# EAGLE design Sensor LF (EAGLE 7.2.0)
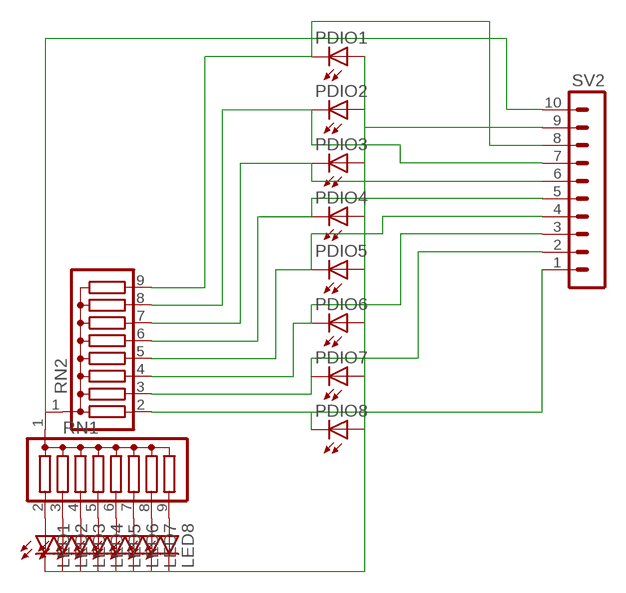
[diagram p0: schematic, sheet 1]

## Parts
LED1  LED3MM  [LED3MM]
LED2  LED3MM  [LED3MM]
LED3  LED3MM  [LED3MM]
LED4  LED3MM  [LED3MM]
LED5  LED3MM  [LED3MM]
LED6  LED3MM  [LED3MM]
LED7  LED3MM  [LED3MM]
LED8  LED3MM  [LED3MM]
PDIO1  LED3MM  [LED3MM]
PDIO2  LED3MM  [LED3MM]
PDIO3  LED3MM  [LED3MM]
PDIO4  LED3MM  [LED3MM]
PDIO5  LED3MM  [LED3MM]
PDIO6  LED3MM  [LED3MM]
PDIO7  LED3MM  [LED3MM]
PDIO8  LED3MM  [LED3MM]
RN1  G08R  [SIL9]
RN2  G08R  [SIL9]
SV2  MA10-1  [MA10-1]

## Nets
GND: LED1.K(C) LED2.K(C) LED3.K(C) LED4.K(C) LED5.K(C) LED6.K(C) LED7.K(C) LED8.K(C) PDIO1.A PDIO2.A PDIO3.A PDIO4.A PDIO5.A PDIO6.A PDIO7.A PDIO8.A SV2.9
N$2: LED1.A RN1.2
N$3: LED2.A RN1.3
N$4: LED3.A RN1.4
N$5: LED4.A RN1.5
N$6: LED5.A RN1.6
N$7: LED6.A RN1.7
N$8: LED7.A RN1.8
N$9: LED8.A RN1.9
N$10: PDIO8.K(C) RN2.2 SV2.1
N$12: PDIO6.K(C) RN2.4 SV2.3
N$15: PDIO3.K(C) RN2.7 SV2.6
N$16: PDIO2.K(C) RN2.8 SV2.7
N$18: PDIO7.K(C) RN2.3 SV2.2
N$23: PDIO5.K(C) RN2.5 SV2.4
N$25: PDIO4.K(C) RN2.6 SV2.5
N$29: PDIO1.K(C) RN2.9 SV2.8
VCC: RN1.1 RN2.1 SV2.10

## Library data of the parts
LED1-LED8 PDIO1-PDIO8 = led:LED: LED OSRAM: - CHIPLED LG R971, LG N971, LY N971, LG Q971, LY Q971, LO R971, LY R971 LH N974, LH R974 LS Q976, LO Q976, LY Q976 LO Q996 - Hyper CHIPLED LW Q18S LB Q993, LB Q99A, LB R99A - SideLED LS A670, LO A670, LY A670, LG A670, LP A670 LB A673, LV A673, LT A673, LW A673 LH A674 LY A675 LS A676, LA A676, LO A676, LY A676, LW A676 LS A679, LY A679, LG A679 - Hyper Micro SIDELED® LS Y876, LA Y876, LO Y876, LY Y876 LT Y87S - SmartLED LW L88C, LW L88S LB L89C, LB L89S, LG L890 LS L89K, LO L89K, LY L89K LS L896, LA L896, LO L896, LY L896 - TOPLED LS T670, LO T670, LY T670, LG T670, LP T670 LSG T670, LSP T670, LSY T670, LOP T670, LYG T670 LG T671, LOG T671, LSG T671 LB T673, LV T673, LT T673, LW T673 LH T674 LS T676, LA T676, LO T676, LY T676, LB T676, LH T676, LSB T676, LW T676 LB T67C, LV T67C, LT T67C, LS T67K, LO T67K, LY T67K, LW E67C LS E67B, LA E67B, LO E67B, LY E67B, LB E67C, LV E67C, LT E67C LW T67C LS T679, LY T679, LG T679 LS T770, LO T770, LY T770, LG T770, LP T770 LB T773, LV T773, LT T773, LW T773 LH T774 LS E675, LA E675, LY E675, LS T675 LS T776, LA T776, LO T776, LY T776, LB T776 LHGB T686 LT T68C, LB T68C - Hyper Mini TOPLED® LB M676 - Mini TOPLED Santana® LG M470 LS M47K, LO M47K, LY M47K Source: http://www.osram.convergy.de LUXEON: - LUMILED® LXK2-PW12-R00, LXK2-PW12-S00, LXK2-PW14-U00, LXK2-PW14-V00 LXK2-PM12-R00, LXK2-PM12-S00, LXK2-PM14-U00 LXK2-PE12-Q00, LXK2-PE12-R00, LXK2-PE12-S00, LXK2-PE14-T00, LXK2-PE14-U00 LXK2-PB12-K00, LXK2-PB12-L00, LXK2-PB12-M00, LXK2-PB14-N00, LXK2-PB14-P00, LXK2-PB14-Q00 LXK2-PR12-L00, LXK2-PR12-M00, LXK2-PR14-Q00, LXK2-PR14-R00 LXK2-PD12-Q00, LXK2-PD12-R00, LXK2-PD12-S00 LXK2-PH12-R00, LXK2-PH12-S00 LXK2-PL12-P00, LXK2-PL12-Q00, LXK2-PL12-R00 Source: www.luxeon.com KINGBRIGHT: KA-3528ASYC Source: www.kingbright.com
RN1 RN2 = resistor-sil:G08R: SIL RESISTOR; OC_FARNELL: unknown; OC_NEWARK: unknown
SV2 = con-lstb:MA10-1: PIN HEADER; OC_FARNELL: unknown; OC_NEWARK: unknown

## Net classes
0 default: width 0.051 mm, clearance 0.051 mm

## Board
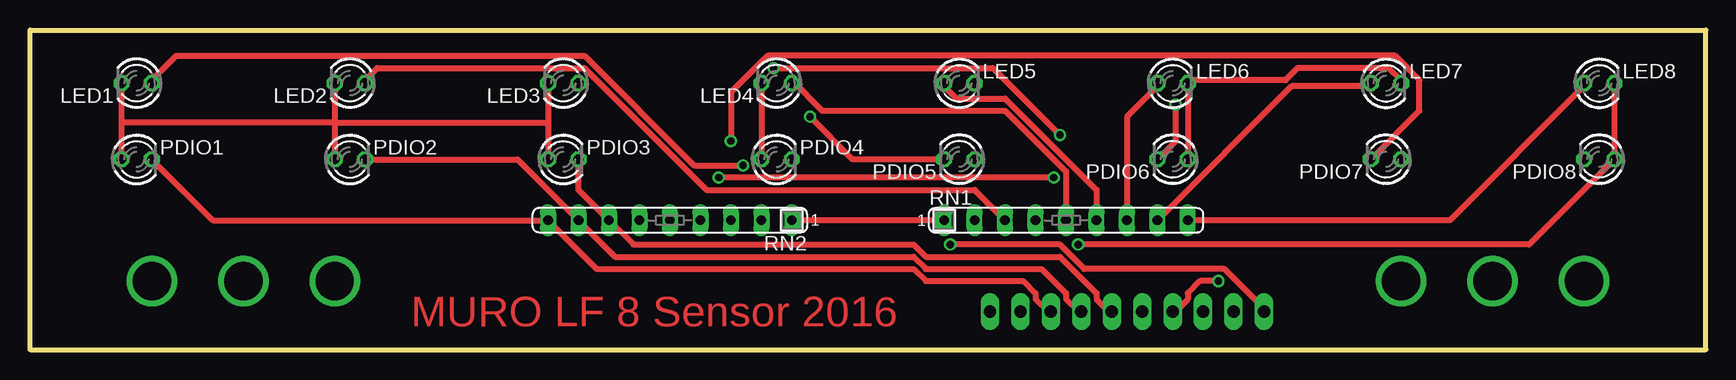
[diagram p1: board, top side]
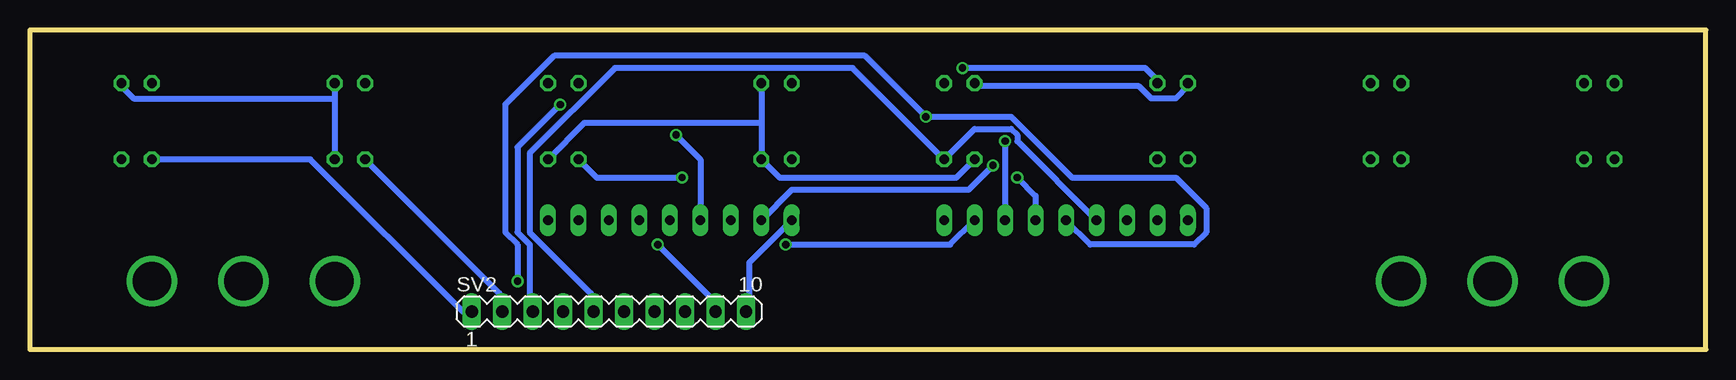
[diagram p2: board, bottom side, seen from below]

Size 139.7 x 26.67 mm. Coordinates in mm from the lower left corner, seen from the top.
Outline: 0,0 139.7,0 139.7,26.67 0,26.67 0,0
Copper layers (1*16): Top 0.035mm / dielectric 1.5mm / Bottom 0.035mm
Design rules "default *": minimum track width 20mil, minimum drill 24mil, track to track 8mil, track to pad 8mil, pad to pad 8mil, via to via 8mil, smd to smd 8mil, copper to edge 40mil, drill to drill 8mil, minimum pad ring 10mil, minimum via ring 8mil, stop-mask expansion 4mil, vias tented up to drill 0mil, thermal gap 10mil

### Footprints (pad centres in the part's own frame; a part is rotated, then mirrored left to right if it is on the bottom)
LED3MM = drill 0.813 octagon: A -1.27,0; K 1.27,0
SIL9 = drill 0.813 long: 1 -10.16,0; 2 -7.62,0; 3 -5.08,0; 4 -2.54,0; 5 0,0; 6 2.54,0; 7 5.08,0; 8 7.62,0; 9 10.16,0
MA10-1 = drill 1.016 long: 1 -11.43,0; 2 -8.89,0; 3 -6.35,0; 4 -3.81,0; 5 -1.27,0; 6 1.27,0; 7 3.81,0; 8 6.35,0; 9 8.89,0; 10 11.43,0

### Placement (x,y rotation side)
LED1  8.89,22.23 180 top
LED2  26.67,22.23 180 top
LED3  44.45,22.23 180 top
LED4  62.23,22.23 180 top
LED5  77.47,22.23 0 top
LED6  95.25,22.23 0 top
LED7  113.03,22.23 0 top
LED8  130.81,22.23 0 top
PDIO1  8.89,15.88 0 top
PDIO2  26.67,15.88 0 top
PDIO3  44.45,15.88 0 top
PDIO4  62.23,15.88 0 top
PDIO5  77.47,15.88 180 top
PDIO6  95.25,15.88 180 top
PDIO7  113.03,15.88 180 top
PDIO8  130.81,15.88 180 top
RN1  86.36,10.8 0 top
RN2  53.34,10.8 180 top
SV2  91.44,3.18 0 bottom

### Tracks (layer width: path | path; a pad name or v marks a point on that pad's centre or on a via)
A  (via drill 3.2)
  other vias: 129.54,5.72
GND  (via drill 0.61)
  Top 0.508: LED4.K PDIO4.A | LED3.K 43.18,18.92 | 43.18,18.92 PDIO3.A | LED1.K 7.62,18.92 | 7.62,18.92 PDIO1.A | LED2.K 25.4,18.92 | 25.4,18.92 PDIO2.A | 25.4,18.92 7.62,18.92 | 25.4,18.92 43.18,18.92 | PDIO6.A LED6.K 96.52,22.48 104.65,22.48 105.66,23.5 113.28,23.5 114.3,22.48 LED7.K | LED8.K PDIO8.A 124.97,8.76 v87.38,8.76
  Bottom 0.508: LED4.K 60.96,21.97 47.24,21.97 46.23,20.96 44.2,20.96 43.18,21.97 LED3.K | LED5.K 78.74,18.92 | 78.74,18.92 PDIO5.A 77.22,14.35 62.48,14.35 PDIO4.A | 78.74,18.92 93.47,18.92 PDIO6.A | LED7.K 114.3,20.96 | 114.3,20.96 PDIO7.A | v87.38,8.76 82.8,4.19 82.8,3.18 SV2.9 | 114.3,20.96 131.06,20.96 132.08,21.97 LED8.K
N$2  (via drill 0.61)
  Top 0.508: v59.44,15.37 55.37,15.37 46.23,24.51 12.19,24.51 10.16,22.48 LED1.A
  Bottom 0.508: RN1.2 76.2,13.34 61.47,13.34 v59.44,15.37
N$3
  Top 0.508: RN1.3 78.74,13.34 56.39,13.34 46.23,23.5 28.96,23.5 27.94,22.48 LED2.A
N$4  (via drill 0.61)
  Top 0.508: v85.85,17.91 80.26,23.5 v61.98,23.5
  Bottom 0.508: RN1.4 83.82,15.88 v85.85,17.91 | v61.98,23.5 46.74,23.5 45.72,22.48 LED3.A
N$5
  Top 0.508: RN1.5 86.36,14.86 81.28,19.94 66.04,19.94 63.5,22.48 LED4.A
N$6
  Top 0.508: RN1.6 88.9,13.34 81.28,20.96 77.22,20.96 76.2,21.97 LED5.A
N$7
  Top 0.508: RN1.7 91.44,19.43 93.98,21.97 LED6.A
N$8
  Top 0.508: RN1.8 105.16,21.97 111.76,21.97 LED7.A
N$9
  Top 0.508: RN1.9 118.36,10.8 129.54,21.97 LED8.A
N$10  (via drill 0.61)
  Top 0.508: v76.71,8.76 85.85,8.76 87.88,6.73 99.57,6.73 103.12,3.18 SV2.1
  Bottom 0.508: RN2.2 62.99,8.76 v76.71,8.76 | PDIO8.K 116.33,15.88 103.63,3.18 SV2.1
N$12  (via drill 0.61)
  Top 0.508: v85.34,14.35 v57.4,14.35 | v95.5,20.45 95.5,17.4 PDIO6.K
  Bottom 0.508: RN2.4 55.88,12.83 v57.4,14.35 | v85.34,14.35 92.46,14.35 PDIO6.K | v95.5,20.45 99.06,16.89 99.06,9.78 98.04,8.76 98.04,3.18 SV2.3
N$15
  Top 0.508: PDIO3.K 45.72,13.34 RN2.7 50.29,8.76 73.66,8.76 74.68,7.75 85.85,7.75 88.9,4.7 88.9,4.19 89.92,3.18 SV2.6
N$16
  Top 0.508: PDIO2.K 40.64,15.88 RN2.8 48.77,7.75 73.66,7.75 74.68,6.73 84.33,6.73 86.36,4.7 86.36,4.19 87.38,3.18 SV2.7
N$18  (via drill 0.61)
  Top 0.508: v58.42,17.4 58.42,21.46 61.47,24.51 113.79,24.51 115.82,22.48 115.82,19.94 PDIO7.K
  Bottom 0.508: v58.42,17.4 RN2.3 | PDIO7.K 100.58,4.7 100.58,3.18 SV2.2
N$20  (via drill 3.2)
  other vias: 17.78,5.72
N$21  (via drill 3.2)
  other vias: 25.4,5.72
N$22  (via drill 3.2)
  other vias: 10.16,5.72
N$23  (via drill 0.61)
  Top 0.508: v65.02,19.43 68.58,15.88 PDIO5.K | v99.06,5.72 97.54,5.72 96.52,4.7 96.52,4.19 95.5,3.18 SV2.4
  Bottom 0.508: RN2.5 51.31,8.76 42.67,8.76 41.66,9.78 41.66,11.81 44.2,14.35 52.83,14.35 57.91,19.43 v65.02,19.43 70.1,24.51 96.01,24.51 100.08,20.45 100.08,9.78 99.06,8.76 v99.06,5.72
N$24  (via drill 3.2)
  other vias: 114.3,5.72
N$25
  Bottom 0.508: RN2.6 57.4,17.4 57.4,17.91 57.91,18.42 60.96,18.42 PDIO4.K 71.12,23.5 90.93,23.5 98.04,16.38 98.04,9.78 92.96,4.7 92.96,3.18 SV2.5
N$26  (via drill 3.2)
  other vias: 121.92,5.72
N$29
  Top 0.508: PDIO1.K 15.24,10.8 RN2.9 47.24,6.73 73.66,6.73 74.68,5.72 82.8,5.72 83.82,4.7 83.82,4.19 84.84,3.18 SV2.8
VCC
  Top 0.508: RN1.1 RN2.1
  Bottom 0.508: RN1.1 79.76,7.24 79.76,3.18 SV2.10

### Text on the board
Top: MURO LF 8 Sensor 2016